# Altium schematic sheet SLAYER_PyroActuation.SchDoc
size A; SheetNumber: 3; SheetTotal: 4
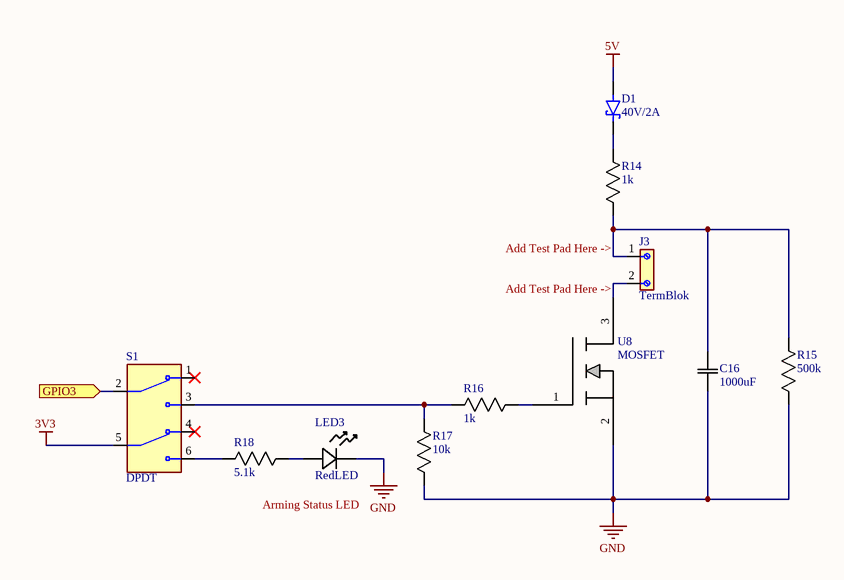
[diagram p0: SLAYER_PyroActuation.SchDoc]

## Parts
C16  1000uF  [1000uF/16V]
D1  40V/2A  [Schotty/40V/2A]
J3  TermBlok  [TerminalBlock]
LED3  RedLED  [RedLED]
R14  1k  [1k/0.125W]
R15  500k  [500k/0.25W]
R16  1k  [1k/0.125W]
R17  10k  [10k/0.125W]
R18  5.1k  [5.1k/0.25W]
S1  DPDT  [SlideSwitch2]
U8  MOSFET  [MOSFET]

## Ports
GPIO3 (in, see SLAYER_ESP32_M1U[3A])

## Nets
3V3: S1.5(COM2)
5V: D1.A
GND: C16.1 LED3.1(CATHODE) R15.2 R17.2 U8.2(S)
GPIO3: S1.2(COM1) ; port GPIO3
NetC16_2: C16.2 J3.1 R14.2 R15.1
NetD1_C: D1.C(K) R14.1
NetJ3_2: J3.2 U8.3(D)
NetLED3_2: LED3.2(ANODE) R18.2
NetR16_1: R16.1 U8.1(G)
NetR16_2: R16.2 R17.1 S1.3(NO1)
NetR18_1: R18.1 S1.6(NO2)

Not connected (* = marked no-connect by the designer): S1 1(NC1)* 4(NC2)*

## Notes on the sheet
- (near J3) Add Test Pad Here ->
- Arming Status LED

## Library data of the parts
C16 = 1000uF/16V: A768MS108M1CLAS015; Manufacturer_Name: Kemet; Type: Aluminum-Polymer Capacitors; Copyright: Copyright (C) 2025 Ultra Librarian. All rights reserved.; Manufacturer_Part_Number: A768MS108M1CLAS015
D1 = Schottky/40V/2A: SS24; MF: Taiwan Semiconductor; Package: SMB-2 Taiwan Semiconductor; Price: None; Value: *; SnapEDA_Link: https://www.snapeda.com/parts/SS24/Taiwan+Semiconductor/view-part/?ref=snap; MP: SS24; Availability: In Stock; Check_prices: https://www.snapeda.com/parts/SS24/Taiwan+Semiconductor/view-part/?ref=eda
J3 = 2TerminalBlock: 691137710002; MF: WÃ¼rth Elektronik; SnapEDA_Link: https://www.snapeda.com/parts/691137710002/W%25C3%25BCrth+Elektronik+Midcom/view-part/?ref=snap; Package: None; Value: *; MP: 691137710002; Check_prices: https://www.snapeda.com/parts/691137710002/W%25C3%25BCrth+Elektronik+Midcom/view-part/?ref=eda
LED3 = RedLED: LTST-C190KRKT; Manufacturer_Name: LITE-ON; Type: LED Indication; Copyright: Copyright (C) 2026 Ultra Librarian. All rights reserved.; Manufacturer_Part_Number: LTST-C190KRKT
R14 R16 = 1k/0.125W: CRCW06031K00FKEA; Manufacturer_Name: Vishay; Copyright: Copyright (C) 2026 Ultra Librarian. All rights reserved.; Manufacturer_Part_Number: CRCW06031K00FKEA
R15 = 500k/0.25W: RC1206FR-07470KL; Manufacturer_Name: Yageo; Copyright: Copyright (C) 2026 Ultra Librarian. All rights reserved.; Manufacturer_Part_Number: RC1206FR-07470KL
R17 = 10k/0.125W: CRCW060310K0FKEA; Manufacturer_Name: Vishay; Copyright: Copyright (C) 2025 Ultra Librarian. All rights reserved.; Manufacturer_Part_Number: CRCW060310K0FKEA
R18 = 5.1k/0.25W: CRCW08055K10FKEA; Manufacturer_Name: Vishay; Copyright: Copyright (C) 2026 Ultra Librarian. All rights reserved.; Manufacturer_Part_Number: CRCW08055K10FKEA
S1 = SlideSwitch: GF-126-0159; MF: {'manufacturer': u'CW Industries'}; Package: None; Price: None; Value: *; MP: GF-126-0159; Availability: Unavailable
U8 = AO3400A: Manufacturer_Name: Alpha and Omega Semiconductor; Copyright: Copyright (C) 2025 Ultra Librarian. All rights reserved.; Manufacturer_Part_Number: AO3400A; RefDes: RefDes; Type: Type